# EAGLE design bat-phone Dodo (EAGLE 9.1.1)
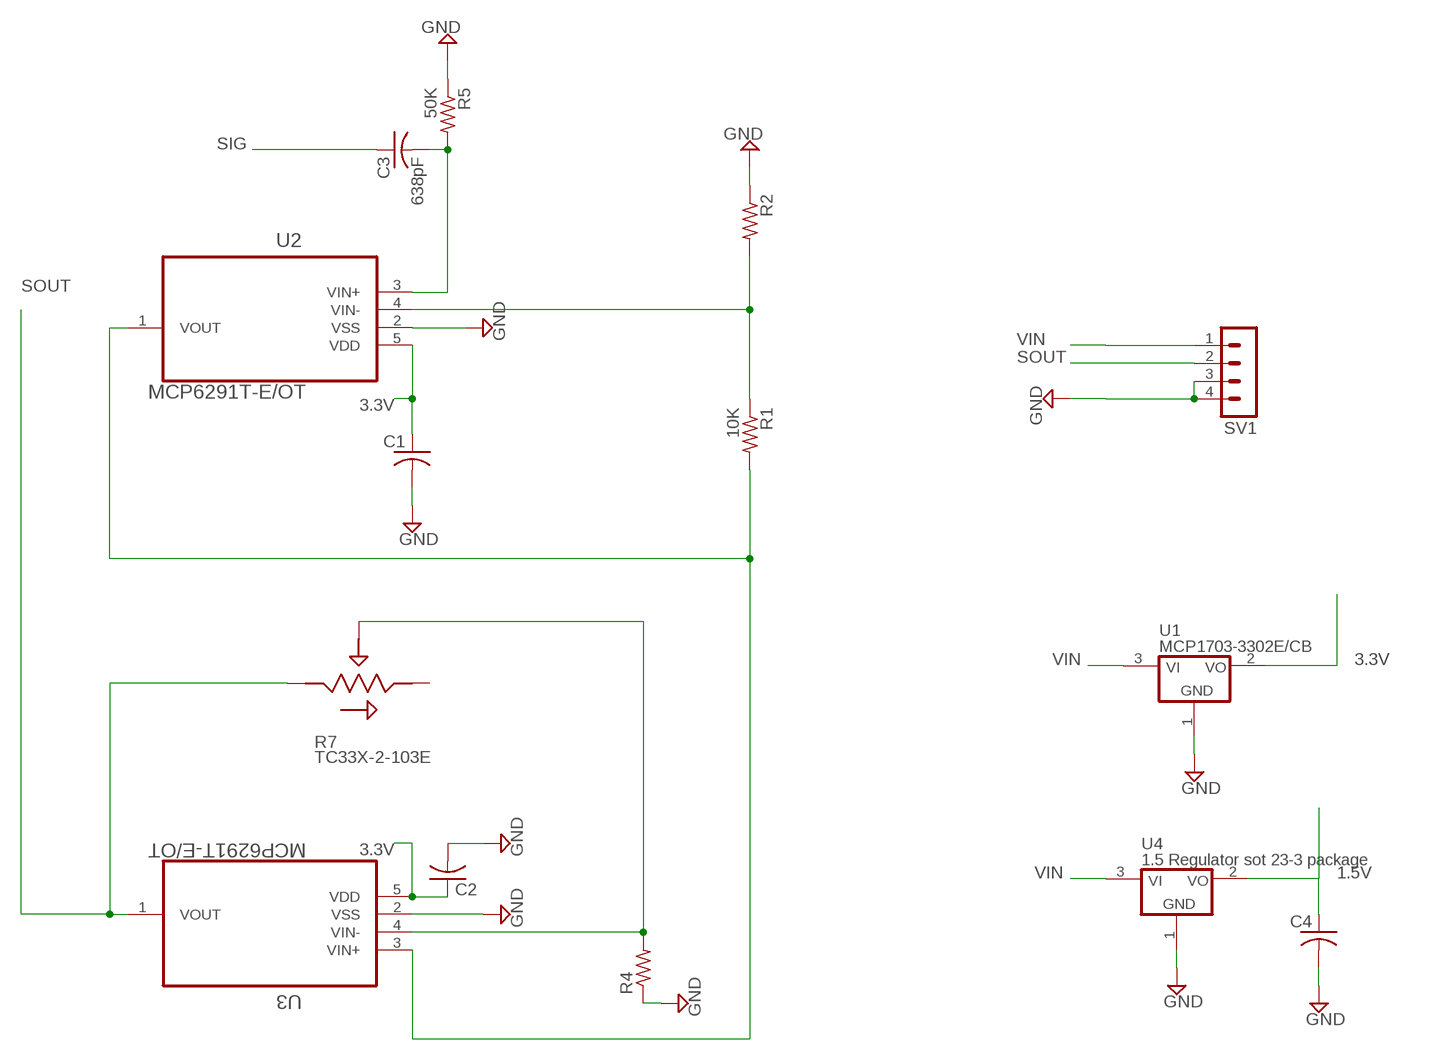
[diagram p0: schematic, sheet 1]

## Parts
C1  C-USC0603K  [C0603K]
C2  C-USC0603K  [C0603K]
C3  638pF  C-USC0603K  [C0603K]
C4  C-USC0603K  [C0603K]
R1  10K  R-US_R0603  [R0603]
R2  R-US_R0603  [R0603]
R4  R-US_R0603  [R0603]
R5  50K  R-US_R0603  [R0603]
R7  TC33X-2-103E  [35WR]
SV1  MA04-1  [MA04-1]
U1  MCP1703-3302E/CB  [SOT23A_MICROCHIP_CB]
U2  MCP6291T-E/OT  [SOT95P320X145-5N]
U3  MCP6291T-E/OT  [SOT95P320X145-5N]
U4  1.5 Regulator sot 23-3 package  MCP1703-3302E/CB  [SOT23A_MICROCHIP_CB]

## Nets
1.5V: C4.1 U4.2(VO)
3.3V: C1.1 C2.1 U1.2(VO) U2.5(VDD) U3.5(VDD)
GND: C1.2 C2.2 C4.2 R2.1 R4.1 R5.1 SV1.3 SV1.4 U1.1(GND) U2.2(VSS) U3.2(VSS) U4.1(GND)
N$1: R1.2 U2.1(VOUT) U3.3(VIN+)
N$2: R1.1 R2.2 U2.4(VIN-)
N$3: R4.2 R7.2 U3.4(VIN-)
N$4: C3.2 R5.2 U2.3(VIN+)
SIG: C3.1
SOUT: R7.1 SV1.2 U3.1(VOUT)
VIN: SV1.1 U1.3(VI) U4.3(VI)
Unconnected: R7.3

## Library data of the parts
C1-C4 = resistor:C-US: CAPACITOR, American symbol
R1 R2 R4 R5 = resistor:R-US_: RESISTOR, American symbol
R7 = TC33X-2-103E:TC33X-2-103E: http://octopart.com/tc33x-2-103e-bourns-68150; AVAILABILITY: Unavailable; DESCRIPTION: Res Trimmer 10K Ohm 25% 0.1W_1/10W_ 1_Elec_/1_Mech_Turn _3 X 3.8mm_ Foot Print SMD Embossed T/R; MF: Bourns; MP: TC33X-2-103E; PACKAGE: FakePackage u; PRICE: None
SV1 = con-lstb:MA04-1: PIN HEADER; OC_FARNELL: unknown; OC_NEWARK: unknown
U1 U4 = MCP1703:MCP1703*02E/CB: MCP1703[A] Series of Voltage Regulators – SOT23A (Microchip CB) (1.2 … 5.0)V, LDO, 16 V Input, 100/150/200/250 mA, Low Quiescent Current Source: http://ww1.microchip.com/downloads/en/DeviceDoc/22049f.pdf http://ww1.microchip.com/downloads/en/DeviceDoc/25122A.pdf Packages: SOT23, Microchip package identifier "CB" (dimensions and recommended land patterns acc. to Microchip) Technologies: MCP1703[A]T-xx02E/CB T : Tape and Reel xx: Output Voltage * 1000 mV; 12|15|18|25|28|30|33|40|50 0 : Extra Feature Code (fixed) 2 : Output volt. Tol.: ±2% (standard) E : Temperature range (−40…+125)°C CB: Package: SOT23A Author: Dipl.-Ing. FH Rainer Bayer HHN Hochschule Heilbronn, rainer.bayer@hs-heilbronn.de Ingenieurbüro ing-rb, mail@ing-rb.de
U2 U3 = MCP6291T-E_OT:MCP6291T-E/OT: OP AMP, 10MHZ, SINGLE; AVAILABILITY: Good; DESCRIPTION: MCP6291 Series 6 V 10 MHz Rail-to-Rail I/O Operational Amplifier - SOT-23-5; MF: Microchip; MP: MCP6291T-E/OT; PACKAGE: SOT-23 Microchip; PRICE: 0.58 USD

## Board
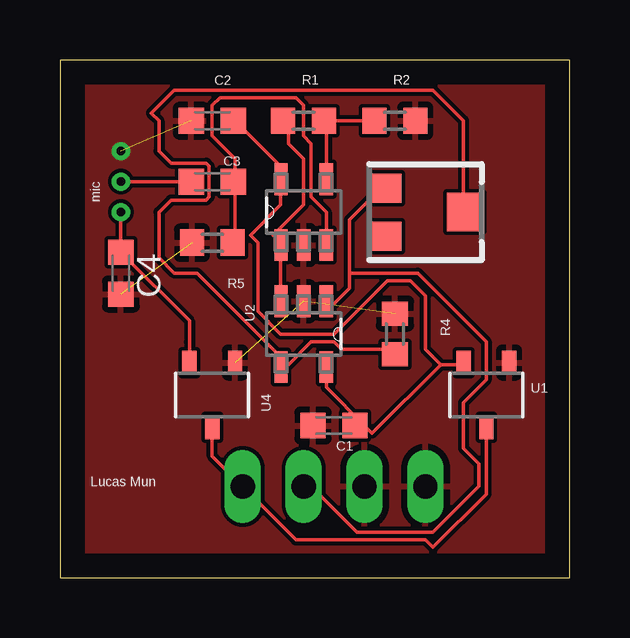
[diagram p1: board, top side]
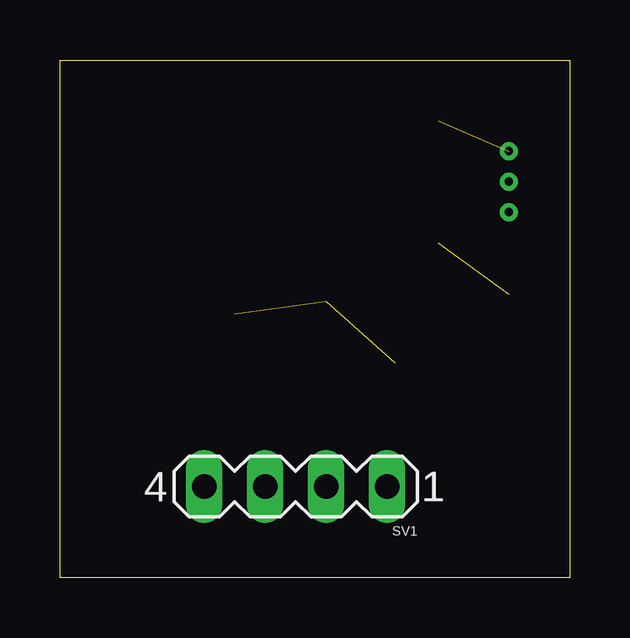
[diagram p2: board, bottom side, seen from below]

Size 21.26 x 21.58 mm. Coordinates in mm from the lower left corner, seen from the top.
Outline: 0,0 21.26,0 21.26,21.58 0,21.58 0,0
Copper layers (1*16): Top 0.035mm / dielectric 1.5mm / Bottom 0.035mm
Design rules "default": minimum track width 6mil, minimum drill 0.35mm, track to track 6mil, track to pad 6mil, pad to pad 6mil, via to via 6mil, smd to smd 6mil, copper to edge 40mil, drill to drill 6mil, minimum pad ring 10mil, minimum via ring 8mil, stop-mask expansion 4mil, vias tented up to drill 0mil, thermal gap 10mil

### Footprints (pad centres in the part's own frame; a part is rotated, then mirrored left to right if it is on the bottom)
C0603K = smd 1.05 x 1.08: 1 -0.875,0; 2 0.875,0
R0603 = smd 1 x 1.1: 1 -0.85,0; 2 0.85,0
35WR = smd 1.2 x 1.2: 1 -1,-1.6; 3 1,-1.6 | smd 1.6 x 1.5: 2 0,1.65
MA04-1 = drill 1.016 long: 1 -3.81,0; 2 -1.27,0; 3 1.27,0; 4 3.81,0
SOT23A_MICROCHIP_CB = smd 0.6 x 1: 1 -0.95,-1.35; 2 0.95,-1.35; 3 0,1.35
SOT95P320X145-5N = smd 1.321 x 0.559: 1 -1.372,0.94; 2 -1.372,0; 3 -1.372,-0.94; 4 1.372,-0.94; 5 1.372,0.94

### Placement (x,y rotation side)
C1  11.43,6.35 180 top
C2  6.35,19.05 180 top
C3  6.35,16.51 0 top
C4  2.54,12.7 270 top
R1  10.16,19.05 180 top
R2  13.97,19.05 180 top
R4  13.97,10.16 270 top
R5  6.35,13.97 0 top
R7  15.24,15.24 270 top
SV1  11.43,3.81 180 bottom
U1  17.78,7.62 180 top
U2  10.16,15.24 90 top
U3  10.16,10.16 270 top
U4  6.35,7.62 180 top

### Tracks (layer width: path | path; a pad name or v marks a point on that pad's centre or on a via)
1.5V  (via drill 0.35)
  Top 0.152: 5.4,9.84 U4.2 5.4,10.71 C4.1 v2.54,15.24
3.3V
  Top 0.152: C2.1 7.3,19.05 9.21,17.14 9.21,16.83 U2.5 9.21,16.51 9.21,15.56 7.94,14.29 8.26,13.97 8.26,11.11 9.21,10.16 11.43,10.16 13.65,12.38 14.61,12.38 15.24,11.75 15.24,9.53 15.88,8.89 | 15.88,8.89 16.83,8.89 U1.2 | 15.88,8.89 13.02,6.03 12.7,6.35 | 12.7,6.35 11.11,7.94 11.11,8.57 U3.5 | 12.7,6.35 C1.1
GND  (via drill 0.35)  (4 unrouted)
  other vias: 2.54,17.78
  pour Top: -1.27,22.86 -1.27,-1.27 22.86,-1.27 22.86,22.86
N$1
  Top 0.152: R1.2 9.53,19.05 9.53,18.1 10.16,17.46 10.16,15.56 8.89,14.29 9.21,13.97 U2.1 9.21,13.65 9.21,11.75 U3.3
N$2
  Top 0.152: R2.2 11.11,19.05 | 11.11,19.05 11.11,16.83 U2.4 | 11.11,19.05 R1.1
N$3
  Top 0.152: 9.53,8.89 9.21,8.57 U3.4 | 9.53,8.89 10.48,9.84 11.43,9.84 11.75,9.53 13.97,9.53 R4.2 | 9.53,8.89 5.71,12.7 4.76,12.7 4.13,13.34 4.13,15.24 4.63,15.74 6.09,15.74 6.23,15.88 6.23,17.14 6.09,17.28 4.63,17.28 4.13,17.78 4.13,19.05 3.81,19.37 4.76,20.32 15.56,20.32 16.83,19.05 16.83,15.24 R7.2
N$4
  Top 0.152: 7.3,16.51 7.3,13.97 R5.2 | 7.3,16.51 7.3,17.46 6.35,18.41 6.35,19.68 6.67,20 9.84,20 10.16,19.68 10.16,18.41 10.48,18.1 10.48,15.88 11.11,15.24 11.11,13.97 U2.3 | 7.3,16.51 C3.2
SIG  (via drill 0.35)
  Top 0.152: v2.54,16.51 C3.1
SOUT
  Top 0.152: 12.06,12.7 12.06,12.06 11.43,11.43 11.11,11.75 U3.1 | 12.06,12.7 12.06,14.92 13.34,16.19 R7.1 | SV1.2 10.48,3.81 12.38,1.91 15.56,1.91 17.46,3.81 17.46,4.76 16.83,5.4 16.83,7.3 17.78,8.26 17.78,9.84 14.92,12.7 12.06,12.7
VIN
  Top 0.152: U4.3 6.35,5.08 SV1.1 9.84,1.59 15.24,1.59 15.56,1.27 17.78,3.49 U1.3

### Text on the board
tPlace: mic | Lucas Mun